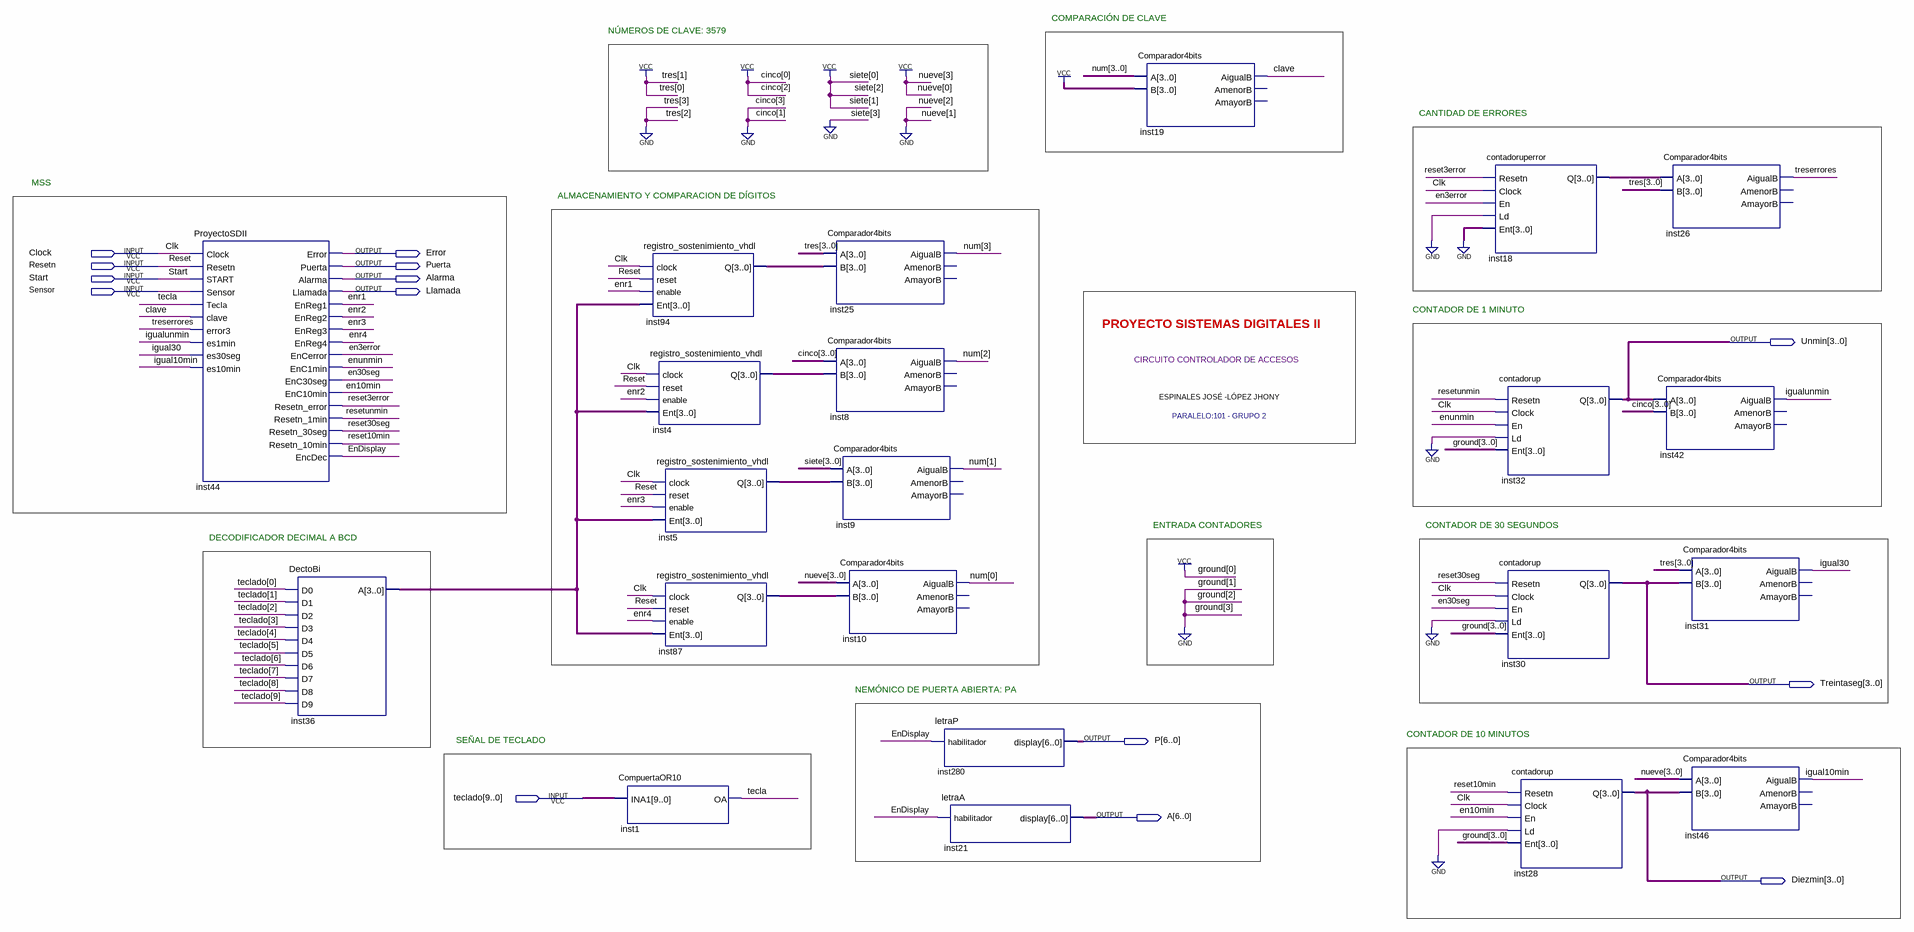
[diagram p0: schematic sheet]
// Quartus schematic DiagramaBloques.bdf as structural Verilog: 22 symbols, 14 pins
module DiagramaBloques (
  input  Clock,
  input  Resetn,
  input  Start,
  input  Sensor,
  input  [9:0] teclado,
  output Error,
  output Puerta,
  output Alarma,
  output Llamada,
  output [3:0] Unmin,
  output [3:0] Treintaseg,
  output [6:0] P,
  output [6:0] A,
  output [3:0] Diezmin
);

  wire clave, en3error, en10min, en30seg, EnDisplay, enr1, enr2, enr3, enr4, enunmin, igual10min, igual30,
       igualunmin, reset3error, reset10min, reset30seg, resetunmin, tecla, treserrores;
  wire [3:0] inst4_q, inst5_q, inst18_q, inst36_a, inst87_q, inst94_q, num;

  ProyectoSDII inst44 (
    .Clock(Clock), .Resetn(Resetn), .START(Start), .Sensor(Sensor), .Tecla(tecla), .clave(clave),
    .error3(treserrores), .es1min(igualunmin), .es30seg(igual30), .es10min(igual10min), .Error(Error),
    .Puerta(Puerta), .Alarma(Alarma), .Llamada(Llamada), .EnReg1(enr1), .EnReg2(enr2), .EnReg3(enr3),
    .EnReg4(enr4), .EnCerror(en3error), .EnC1min(enunmin), .EnC30seg(en30seg), .EnC10min(en10min),
    .Resetn_error(reset3error), .Resetn_1min(resetunmin), .Resetn_30seg(reset30seg),
    .Resetn_10min(reset10min), .EncDec(EnDisplay));
  DectoBi inst36 (
    .D0(teclado[0]), .D1(teclado[1]), .D2(teclado[2]), .D3(teclado[3]), .D4(teclado[4]), .D5(teclado[5]),
    .D6(teclado[6]), .D7(teclado[7]), .D8(teclado[8]), .D9(teclado[9]), .A(inst36_a));
  CompuertaOR10 inst1 (.INA1(teclado), .OA(tecla));
  registro_sostenimiento_vhdl inst94 (.clock(Clock), .reset(Resetn), .enable(enr1), .Ent(inst36_a), .Q(inst94_q));
  registro_sostenimiento_vhdl inst4 (.clock(Clock), .reset(Resetn), .enable(enr2), .Ent(inst36_a), .Q(inst4_q));
  registro_sostenimiento_vhdl inst5 (.clock(Clock), .reset(Resetn), .enable(enr3), .Ent(inst36_a), .Q(inst5_q));
  registro_sostenimiento_vhdl inst87 (.clock(Clock), .reset(Resetn), .enable(enr4), .Ent(inst36_a), .Q(inst87_q));
  Comparador4bits inst25 (.A(4'b0011), .B(inst94_q), .AigualB(num[3]));  // open: AmenorB, AmayorB
  Comparador4bits inst8 (.A(4'b0101), .B(inst4_q), .AigualB(num[2]));  // open: AmenorB, AmayorB
  Comparador4bits inst9 (.A(4'b0111), .B(inst5_q), .AigualB(num[1]));  // open: AmenorB, AmayorB
  Comparador4bits inst10 (.A(4'b1001), .B(inst87_q), .AigualB(num[0]));  // open: AmenorB, AmayorB
  letraP inst280 (.habilitador(EnDisplay), .display(P));
  letraA inst21 (.habilitador(EnDisplay), .display(A));
  Comparador4bits inst19 (.A(num), .B(4'b1111), .AigualB(clave));  // open: AmenorB, AmayorB
  contadoruperror inst18 (.Resetn(reset3error), .Clock(Clock), .En(en3error), .Ld(1'b0), .Ent(4'b0000), .Q(inst18_q));
  contadorup inst32 (.Resetn(resetunmin), .Clock(Clock), .En(enunmin), .Ld(1'b0), .Ent(4'b0001), .Q(Unmin));
  contadorup inst30 (.Resetn(reset30seg), .Clock(Clock), .En(en30seg), .Ld(1'b0), .Ent(4'b0001), .Q(Treintaseg));
  contadorup inst28 (.Resetn(reset10min), .Clock(Clock), .En(en10min), .Ld(1'b0), .Ent(4'b0001), .Q(Diezmin));
  Comparador4bits inst26 (.A(inst18_q), .B(4'b0011), .AigualB(treserrores));  // open: AmenorB, AmayorB
  Comparador4bits inst42 (.A(Unmin), .B(4'b0101), .AigualB(igualunmin));  // open: AmenorB, AmayorB
  Comparador4bits inst31 (.A(4'b0011), .B(Treintaseg), .AigualB(igual30));  // open: AmenorB, AmayorB
  Comparador4bits inst46 (.A(4'b1001), .B(Diezmin), .AigualB(igual10min));  // open: AmenorB, AmayorB

  // Other names for the same wires on the sheet: Clk = Clock; Reset = Resetn

  // Notes on the sheet:
  //   COMPARACIÓN DE CLAVE
  //   NÚMEROS DE CLAVE: 3579
  //   CANTIDAD DE ERRORES
  //   MSS
  //   ALMACENAMIENTO Y COMPARACION DE DÍGITOS
  //   CONTADOR DE 1 MINUTO
  //   PROYECTO SISTEMAS DIGITALES II 
  //   CIRCUITO CONTROLADOR DE ACCESOS  
  //   ESPINALES JOSÉ -LÓPEZ JHONY
  //   PARALELO:101 - GRUPO 2
  //   ENTRADA CONTADORES
  //   CONTADOR DE 30 SEGUNDOS
  //   DECODIFICADOR DECIMAL A BCD
  //   NEMÓNICO DE PUERTA ABIERTA: PA
  //   CONTADOR DE 10 MINUTOS
  //   SEÑAL DE TECLADO
endmodule
